# EAGLE schematic schematics (EAGLE 9.1.3)
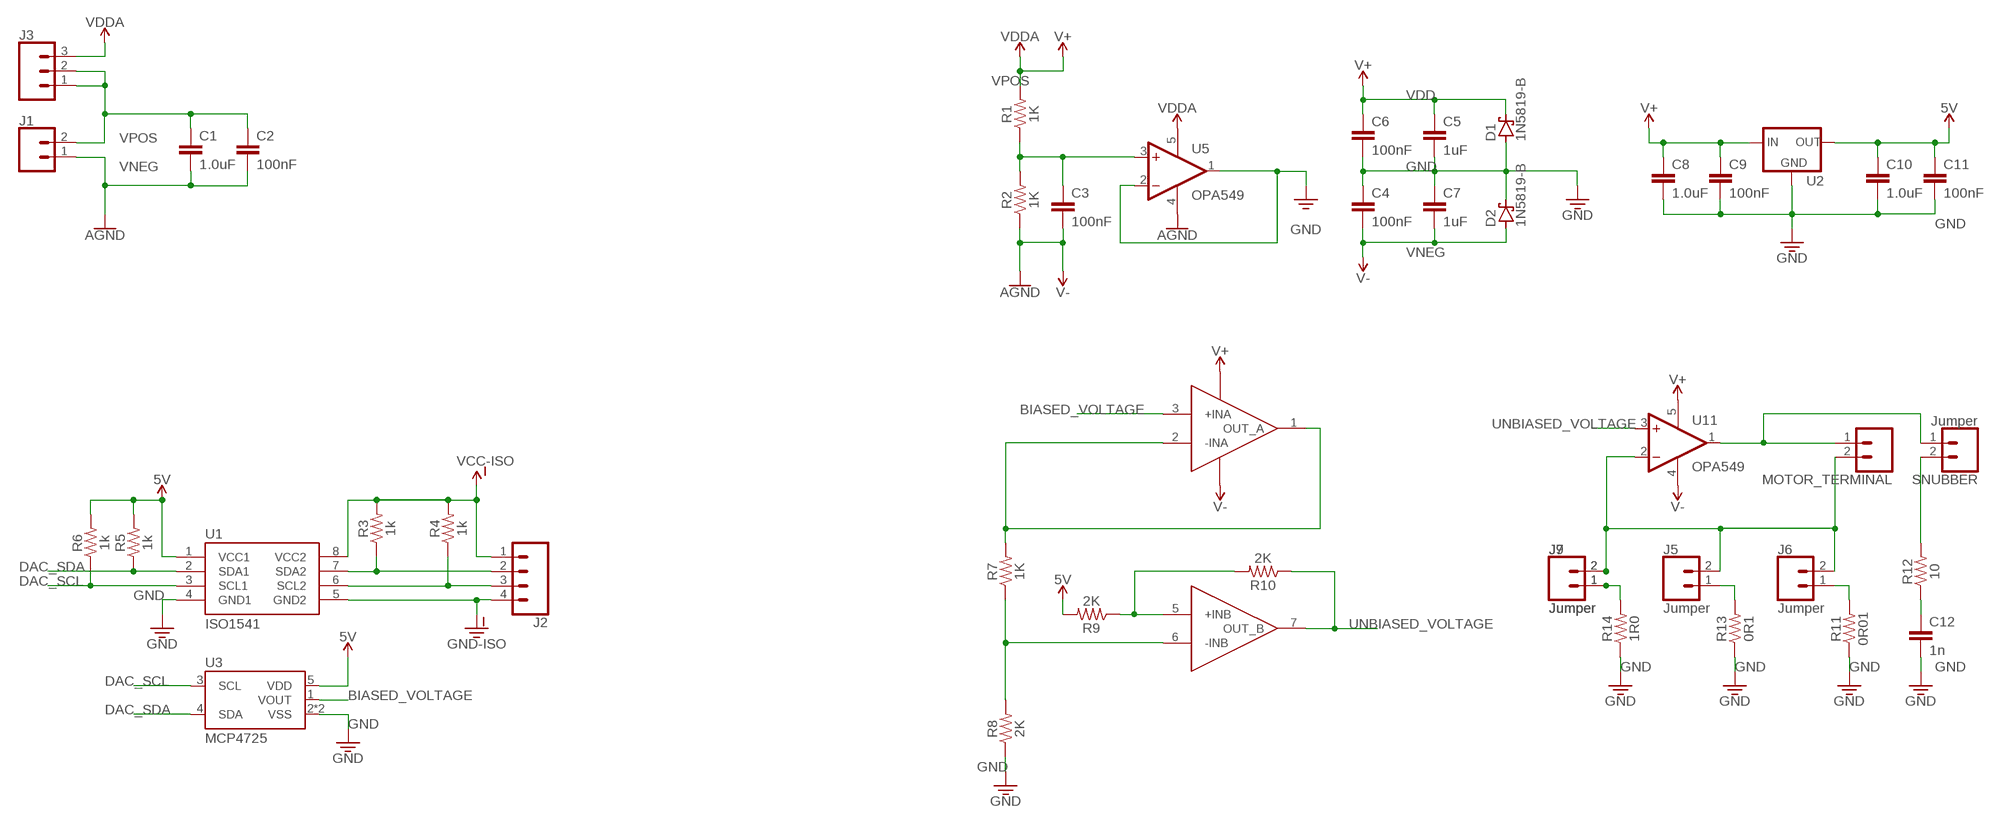
[diagram p0: schematic, sheet 1, part 1 of 2]
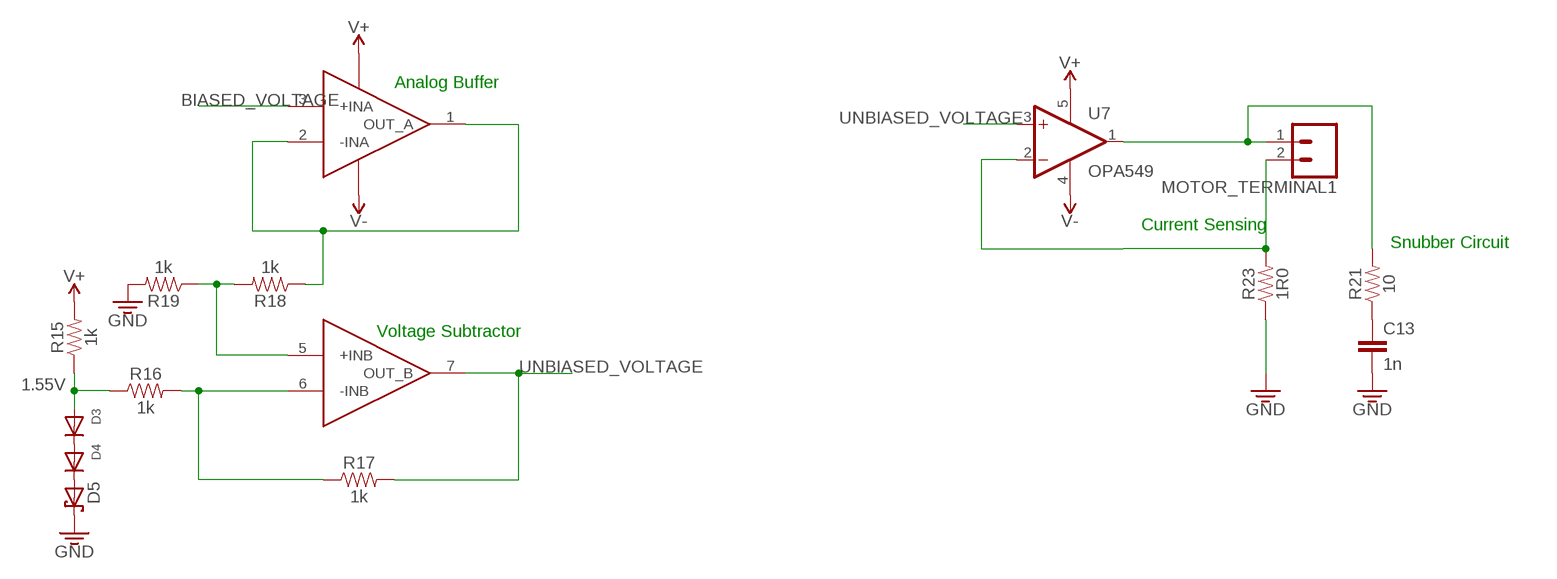
[diagram p1: schematic, sheet 1, part 2 of 2]

## Parts
C1  1.0uF  1.0UF-1206-50V-10%  [1206]
C2  100nF  1.0UF-1206-50V-10%  [1206]
C3  100nF  1.0UF-1206-50V-10%  [1206]
C4  100nF  1.0UF-1206-50V-10%  [1206]
C5  1uF  1.0UF-1206-50V-10%  [1206]
C6  100nF  1.0UF-1206-50V-10%  [1206]
C7  1uF  1.0UF-1206-50V-10%  [1206]
C8  1.0uF  1.0UF-1206-50V-10%  [1206]
C9  100nF  1.0UF-1206-50V-10%  [1206]
C10  1.0uF  1.0UF-1206-50V-10%  [1206]
C11  100nF  1.0UF-1206-50V-10%  [1206]
C12  1n  1.0UF-1206-50V-10%  [1206]
C13  1n  1.0UF-1206-50V-10%  [1206]
D1  1N5819-B  [DO41-7.6]
D2  1N5819-B  [DO41-7.6]
D3  DIODEDO-1N4148  [DO-1N4148]
D4  DIODEDO-1N4148  [DO-1N4148]
D5  SCHOTTKY-DIODEAG  [AG]
J1  CONN_025MM  [SCREWTERMINAL-5MM-2]
J2  CONN_04LONGPADS  [1X04_LONGPADS]
J3  CONN_03LONGPADS  [1X03_LONGPADS]
J5  Jumper  CONN_02PTH3  [1X02_LONGPADS]
J6  Jumper  CONN_02PTH3  [1X02_LONGPADS]
J7  Jumper  CONN_02PTH3  [1X02_LONGPADS]
J9  Jumper  CONN_02PTH3  [1X02_LONGPADS]
MOTOR_TERMINAL  CONN_025MM  [SCREWTERMINAL-5MM-2]
MOTOR_TERMINAL1  CONN_025MM  [SCREWTERMINAL-5MM-2]
R1  1K  RESISTOR1206  [1206]
R2  1K  RESISTOR1206  [1206]
R3  1k  RESISTOR1206  [1206]
R4  1k  RESISTOR1206  [1206]
R5  1k  RESISTOR1206  [1206]
R6  1k  RESISTOR1206  [1206]
R7  1K  RESISTOR1206  [1206]
R8  2K  RESISTOR1206  [1206]
R9  2K  RESISTOR1206  [1206]
R10  2K  RESISTOR1206  [1206]
R11  0R01  RESISTOR1206  [1206]
R12  10  RESISTOR1206  [1206]
R13  0R1  RESISTOR1206  [1206]
R14  1R0  RESISTOR1206  [1206]
R15  1k  RESISTOR1206  [1206]
R16  1k  RESISTOR1206  [1206]
R17  1k  RESISTOR1206  [1206]
R18  1k  RESISTOR1206  [1206]
R19  1k  RESISTOR1206  [1206]
R21  10  RESISTOR1206  [1206]
R23  1R0  RESISTOR1206  [1206]
SNUBBER  Jumper  CONN_02PTH3  [1X02_LONGPADS]
U1  ISO1541  [DIP254P762X508-8]
U2  V_REG_78XXSINK  [TO220-IGO]
U3  MCP4725  [1X06_LONGPADS]
U4  LM833N  [DIP254P762X508-8]
U5  OPA549  [1X05_LONGPADS]
U6  LM833N  [DIP254P762X508-8]
U7  OPA549  [1X05_LONGPADS]
U11  OPA549  [1X05_LONGPADS]

## Nets
1.55V: D3.A R15.1 R16.1
3.3V: D5.C R19.2 ; supply symbol labelled GND
5V: C10.1 C11.1 R5.2 R6.2 R9.2 U1.1(VCC1) U2.OUT U3.5(VDD)
AGND: U5.4(V-)
BIASED_VOLTAGE: U3.1(VOUT) U4.3(+INA) U6.3(+INA)
DAC_SCL: R6.1 U1.3(SCL1) U3.3(SCL)
DAC_SDA: R5.1 U1.2(SDA1) U3.4(SDA)
GND: C4.1 C5.2 C6.2 C7.1 C8.2 C9.2 C10.2 C11.2 C12.2 C13.2 D1.A D2.C R8.1 R11.1 R13.1 R14.1 R23.1 U1.4(GND1) U2.GND U3.2(VSS) U3.6(VSS) U5.1(OUT) U5.2(-IN)
GND-ISO: J2.4 U1.5(GND2)
N$1: C3.1 R1.1 R2.2 U5.3(+IN)
N$2: R12.2 SNUBBER.2
N$3: J2.2 R3.1 U1.7(SDA2)
N$4: J2.3 R4.1 U1.6(SCL2)
N$5: R7.2 U4.1(OUT_A) U4.2(-INA)
N$6: R7.1 R8.2 U4.6(-INB)
N$7: R9.1 R10.2 U4.5(+INB)
N$9: MOTOR_TERMINAL.1 SNUBBER.1 U11.1(OUT)
N$10: C12.1 R12.1
N$11: J7.1 J9.1 R14.2
N$12: J5.2 J6.2 J7.2 J9.2 MOTOR_TERMINAL.2 U11.2(-IN)
N$13: R18.1 U6.1(OUT_A) U6.2(-INA)
N$14: J5.1 R13.2
N$15: J6.1 R11.2
N$16: C13.1 R21.1
N$17: D3.C D4.A
N$18: D4.C D5.A
N$19: R16.2 R17.1 U6.6(-INB)
N$20: MOTOR_TERMINAL1.1 R21.2 U7.1(OUT)
N$22: R18.2 R19.1 U6.5(+INB)
N$23: MOTOR_TERMINAL1.2 R23.2 U7.2(-IN)
UNBIASED_VOLTAGE: R10.1 R17.2 U4.7(OUT_B) U6.7(OUT_B) U7.3(+IN) U11.3(+IN)
VCC-ISO: J2.1 R3.2 R4.2 U1.8(VCC2)
VDD: C5.1 C6.1 D1.C R15.2 U4.8(+VCC) U6.8(+VCC) U7.5(V+) U11.5(V+) ; supply symbol labelled V+
VDDA: U5.5(V+)
VNEG: C1.2 C2.2 C3.2 C4.2 C7.2 D2.A J1.1 R2.1 U4.4(-VEE) U6.4(-VEE) U7.4(V-) U11.4(V-) ; supply symbol labelled AGND, V-
VPOS: C1.1 C2.1 C8.1 C9.1 J1.2 J3.1 J3.2 J3.3 R1.2 U2.IN ; supply symbol labelled V+, VDDA

## Notes on the sheet
- Analog Buffer
- Current Sensing
- Snubber Circuit
- Voltage Subtractor

## Library data of the parts
C1 C8 C10 = SparkFun-Capacitors:1.0UF: 1µF ceramic capacitors A capacitor is a passive two-terminal electrical component used to store electrical energy temporarily in an electric field.; PROD_ID: CAP-09822
C2-C7 C9 C11-C13 = SparkFun-Capacitors:1.0UF: 1µF ceramic capacitors A capacitor is a passive two-terminal electrical component used to store electrical energy temporarily in an electric field.; PROD_ID: CAP-09822; VALUE: 1.0uF
D1 D2 = diode:1N581*: 1.0A SCHOTTKY BARRIER RECTIFIER Source: http://www.diodes.com/datasheets/ds23001.pdf
D3 D4 = adafruit:DIODE: Diode SMADIODE - SMA Surface Mount Package 20V 1A Schottky Diode Digikey: 641-1014-6-ND DO-1N4148 - Through Hole Small Current Diode SOD-123 20V 1 A (.5mV Vf) Schottky Diode - Digikey: MBRX120TPMSCT-ND SOD-323 10V 570mA (.38mV Vf, 3ns) Schottky Diode - Digikey: ZLLS410CT-ND SOD-523 30V 30mA Schottky Diode (RB751S-40TE61) - Digikey: RB751S-40TE61CT-ND SOT23-R/W - SOT23 Package (R = Solder Paste/Reflow Ovens, W = Hand-Soldering) BAT54Film 40V 300mA - Digikey: 497-7162-1-ND
D5 = adafruit:SCHOTTKY-DIODE: Schottky Diode
J1 MOTOR_TERMINAL MOTOR_TERMINAL1 = SparkFun-Connectors:CONN_02: Multi connection point. Often used as Generic Header-pin footprint for 0.1 inch spaced/style header connections On any of the 0.1 inch spaced packages, you can populate with these: Break Away Headers - Straight <https://www.sparkfun.com/products/116> (PRT-00116) Break Away Male Headers - Right Angle <https://www.sparkfun.com/products/553> (PRT-00553) Female Headers <https://www.sparkfun.com/products/115> (PRT-00115) Break Away Headers - Machine Pin <https://www.sparkfun.com/products/117> (PRT-00117) Break Away Female Headers - Swiss Machine Pin <https://www.sparkfun.com/products/743> (PRT-00743) For SCREWTERMINALS and SPRING TERMINALS visit here: Screw Terimnals on SparkFun.com <https://www.sparkfun.com/search/results?term=Screw+Terminals> (5mm/3.5mm/2.54mm spacing) This device is also useful as a general connection point to wire up your design to another part of your project. Our various solder wires solder well into these plated through hole pads. Hook-Up Wire - Assortment (Stranded, 22 AWG) <https://www.sparkfun.com/products/11375> (PRT-11375) Hook-Up Wire - Assortment (Solid Core, 22 AWG) <https://www.sparkfun.com/products/11367> (PRT-11367) View the entire wire category on our website here <https://www.sparkfun.com/categories/141> Special notes: Molex polarized connector foot print use with: PRT-08233 with associated crimp pins and housings. 2.54_SCREWTERM for use with PRT-10571. 3.5mm Screw Terminal footprints for PRT-08084 5mm Screw Terminal footprints for use with PRT-08432; SF_SKU: PRT-08432
J2 = SparkFun-Connectors:CONN_04: Multi connection point. Often used as Generic Header-pin footprint for 0.1 inch spaced/style header connections On any of the 0.1 inch spaced packages, you can populate with these: Break Away Headers - Straight <https://www.sparkfun.com/products/116> (PRT-00116) Break Away Male Headers - Right Angle <https://www.sparkfun.com/products/553> (PRT-00553) Female Headers <https://www.sparkfun.com/products/115> (PRT-00115) Break Away Headers - Machine Pin <https://www.sparkfun.com/products/117> (PRT-00117) Break Away Female Headers - Swiss Machine Pin <https://www.sparkfun.com/products/743> (PRT-00743) For SCREWTERMINALS and SPRING TERMINALS visit here: Screw Terimnals on SparkFun.com <https://www.sparkfun.com/search/results?term=Screw+Terminals> (5mm/3.5mm/2.54mm spacing) This device is also useful as a general connection point to wire up your design to another part of your project. Our various solder wires solder well into these plated through hole pads. Hook-Up Wire - Assortment (Stranded, 22 AWG) <https://www.sparkfun.com/products/11375> (PRT-11375) Hook-Up Wire - Assortment (Solid Core, 22 AWG) <https://www.sparkfun.com/products/11367> (PRT-11367) View the entire wire category on our website here <https://www.sparkfun.com/categories/141> Special notes: Molex polarized connector foot print use with SKU : PRT-08231 with associated crimp pins and housings. 1MM SMD Version SKU: PRT-10208; PROD_ID: CONN-09696
J3 = SparkFun-Connectors:CONN_03: Multi connection point. Often used as Generic Header-pin footprint for 0.1 inch spaced/style header connections On any of the 0.1 inch spaced packages, you can populate with these: Break Away Headers - Straight <https://www.sparkfun.com/products/116> (PRT-00116) Break Away Male Headers - Right Angle <https://www.sparkfun.com/products/553> (PRT-00553) Female Headers <https://www.sparkfun.com/products/115> (PRT-00115) Break Away Headers - Machine Pin <https://www.sparkfun.com/products/117> (PRT-00117) Break Away Female Headers - Swiss Machine Pin <https://www.sparkfun.com/products/743> (PRT-00743) Stackable Header - 3 Pin (Female, 0.1") <https://www.sparkfun.com/products/13875> (PRT-13875) For SCREWTERMINALS and SPRING TERMINALS visit here: Screw Terimnals on SparkFun.com <https://www.sparkfun.com/search/results?term=Screw+Terminals> (5mm/3.5mm/2.54mm spacing) This device is also useful as a general connection point to wire up your design to another part of your project. Our various solder wires solder well into these plated through hole pads. Hook-Up Wire - Assortment (Stranded, 22 AWG) <https://www.sparkfun.com/products/11375> (PRT-11375) Hook-Up Wire - Assortment (Solid Core, 22 AWG) <https://www.sparkfun.com/products/11367> (PRT-11367) View the entire wire category on our website here <https://www.sparkfun.com/categories/141> Special notes: Molex polarized connector foot print use with SKU : PRT-08232 with associated crimp pins and housings.
J5-J7 J9 SNUBBER = SparkFun-Connectors:CONN_02: Multi connection point. Often used as Generic Header-pin footprint for 0.1 inch spaced/style header connections On any of the 0.1 inch spaced packages, you can populate with these: Break Away Headers - Straight <https://www.sparkfun.com/products/116> (PRT-00116) Break Away Male Headers - Right Angle <https://www.sparkfun.com/products/553> (PRT-00553) Female Headers <https://www.sparkfun.com/products/115> (PRT-00115) Break Away Headers - Machine Pin <https://www.sparkfun.com/products/117> (PRT-00117) Break Away Female Headers - Swiss Machine Pin <https://www.sparkfun.com/products/743> (PRT-00743) For SCREWTERMINALS and SPRING TERMINALS visit here: Screw Terimnals on SparkFun.com <https://www.sparkfun.com/search/results?term=Screw+Terminals> (5mm/3.5mm/2.54mm spacing) This device is also useful as a general connection point to wire up your design to another part of your project. Our various solder wires solder well into these plated through hole pads. Hook-Up Wire - Assortment (Stranded, 22 AWG) <https://www.sparkfun.com/products/11375> (PRT-11375) Hook-Up Wire - Assortment (Solid Core, 22 AWG) <https://www.sparkfun.com/products/11367> (PRT-11367) View the entire wire category on our website here <https://www.sparkfun.com/categories/141> Special notes: Molex polarized connector foot print use with: PRT-08233 with associated crimp pins and housings. 2.54_SCREWTERM for use with PRT-10571. 3.5mm Screw Terminal footprints for PRT-08084 5mm Screw Terminal footprints for use with PRT-08432
R1-R19 R21 R23 = SparkFun-Resistors:RESISTOR: Generic Resistor Package
U1 = OPA:ISO1541
U2 = SparkFun-IC-Power:V_REG_78XX: Voltage Regulator Standard 78xx regulator. IGO (Input Ground Output). Spark Fun Electronics SKU : COM-00107
U3 = OPA:MCP4725: MCP4725 DAC
U4 U6 = LM833N:LM833N: OP AMP; AVAILABILITY: Unavailable; DESCRIPTION: Dual Audio Operational Amplifier 8-PDIP -40 to 85; MF: Texas Instruments; MP: LM833N; PACKAGE: DIP-8 Texas Instruments; PRICE: None
U5 U7 U11 = OPA:OPA549: OPA549 High Power Opamp